# EAGLE design register (EAGLE 9.6.2)
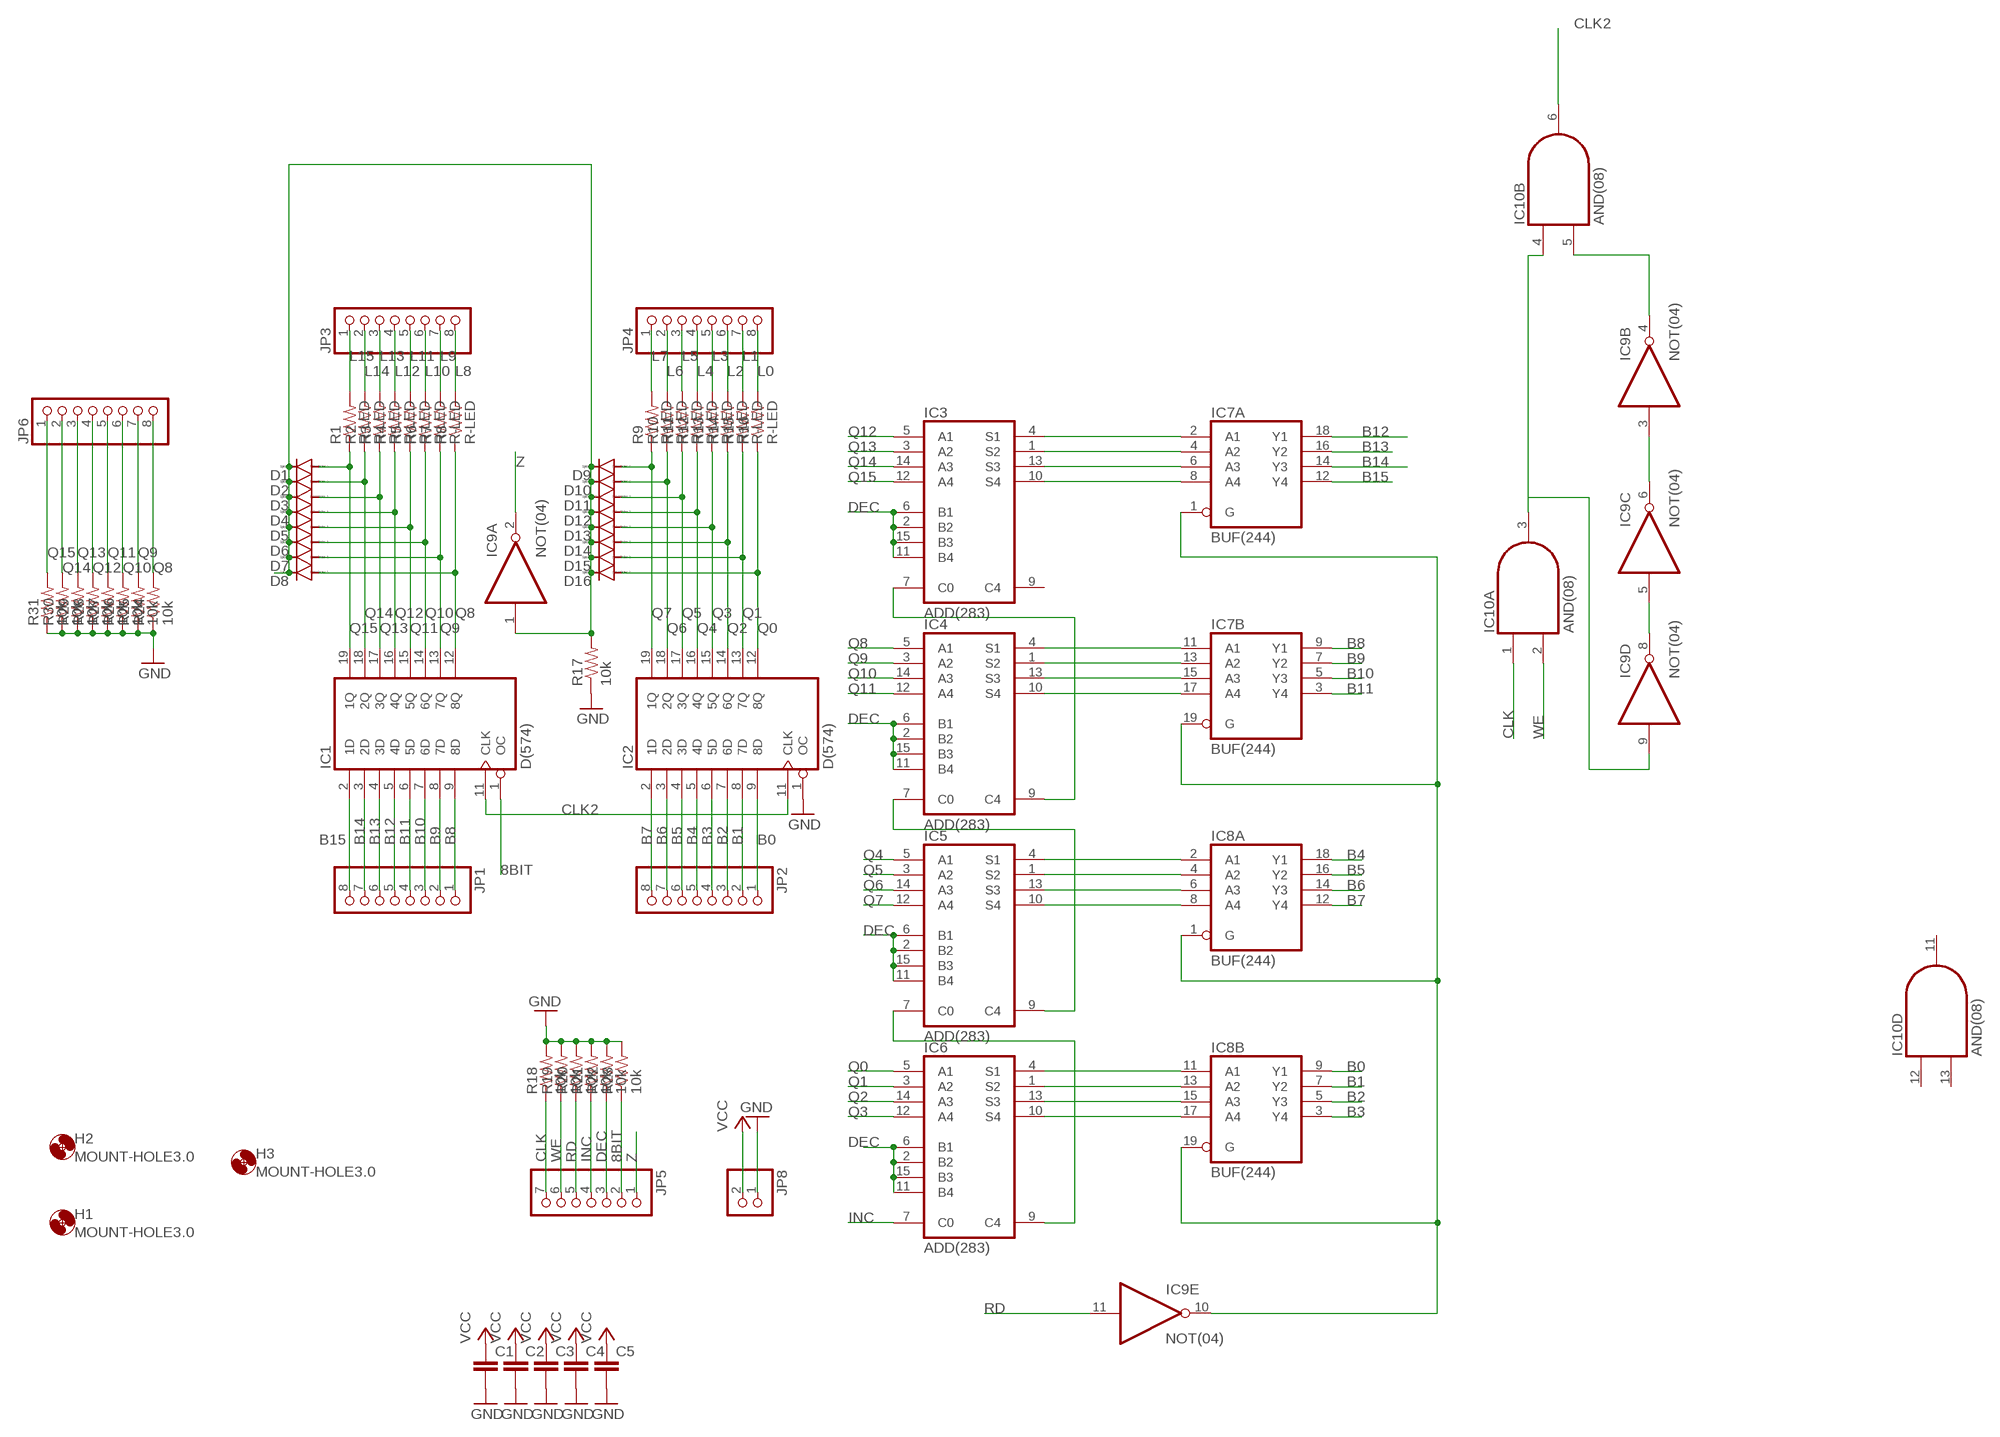
[diagram p0: schematic, sheet 1]

## Parts
C1  C-Decouple  C-EU025-025X050  [C025-025X050]
C2  C-Decouple  C-EU025-025X050  [C025-025X050]
C3  C-Decouple  C-EU025-025X050  [C025-025X050]
C4  C-Decouple  C-EU025-025X050  [C025-025X050]
C5  C-Decouple  C-EU025-025X050  [C025-025X050]
D1  DIODE-D-7.5  [D-7.5]
D2  DIODE-D-7.5  [D-7.5]
D3  DIODE-D-7.5  [D-7.5]
D4  DIODE-D-7.5  [D-7.5]
D5  DIODE-D-7.5  [D-7.5]
D6  DIODE-D-7.5  [D-7.5]
D7  DIODE-D-7.5  [D-7.5]
D8  DIODE-D-7.5  [D-7.5]
D9  DIODE-D-7.5  [D-7.5]
D10  DIODE-D-7.5  [D-7.5]
D11  DIODE-D-7.5  [D-7.5]
D12  DIODE-D-7.5  [D-7.5]
D13  DIODE-D-7.5  [D-7.5]
D14  DIODE-D-7.5  [D-7.5]
D15  DIODE-D-7.5  [D-7.5]
D16  DIODE-D-7.5  [D-7.5]
H1  MOUNT-HOLE3.0  [3,0]
H2  MOUNT-HOLE3.0  [3,0]
H3  MOUNT-HOLE3.0  [3,0]
IC1  D(574)  74AS574N  [DIL20]
IC2  D(574)  74AS574N  [DIL20]
IC3  ADD(283)  74AC283N  [DIL16]
IC4  ADD(283)  74AC283N  [DIL16]
IC5  ADD(283)  74AC283N  [DIL16]
IC6  ADD(283)  74AC283N  [DIL16]
IC7  BUF(244)  74AC244N  [DIL20]
IC8  BUF(244)  74AC244N  [DIL20]
IC9  NOT(04)  74ALS04N  [DIL14]
IC10  AND(08)  74ALS08N  [DIL14]
JP1  PINHD-1X8  [1X08]
JP2  PINHD-1X8  [1X08]
JP3  PINHD-1X8  [1X08]
JP4  PINHD-1X8  [1X08]
JP5  PINHD-1X7  [1X07]
JP6  PINHD-1X8  [1X08]
JP8  PINHD-1X2  [1X02]
R1  R-LED  R-US_0204/7  [0204/7]
R2  R-LED  R-US_0204/7  [0204/7]
R3  R-LED  R-US_0204/7  [0204/7]
R4  R-LED  R-US_0204/7  [0204/7]
R5  R-LED  R-US_0204/7  [0204/7]
R6  R-LED  R-US_0204/7  [0204/7]
R7  R-LED  R-US_0204/7  [0204/7]
R8  R-LED  R-US_0204/7  [0204/7]
R9  R-LED  R-US_0204/7  [0204/7]
R10  R-LED  R-US_0204/7  [0204/7]
R11  R-LED  R-US_0204/7  [0204/7]
R12  R-LED  R-US_0204/7  [0204/7]
R13  R-LED  R-US_0204/7  [0204/7]
R14  R-LED  R-US_0204/7  [0204/7]
R15  R-LED  R-US_0204/7  [0204/7]
R16  R-LED  R-US_0204/7  [0204/7]
R17  10k  R-US_0204/7  [0204/7]
R18  10k  R-US_0204/7  [0204/7]
R19  10k  R-US_0204/7  [0204/7]
R20  10k  R-US_0204/7  [0204/7]
R21  10k  R-US_0204/7  [0204/7]
R22  10k  R-US_0204/7  [0204/7]
R23  10k  R-US_0204/7  [0204/7]
R24  10k  R-US_0204/7  [0204/7]
R25  10k  R-US_0204/7  [0204/7]
R26  10k  R-US_0204/7  [0204/7]
R27  10k  R-US_0204/7  [0204/7]
R28  10k  R-US_0204/7  [0204/7]
R29  10k  R-US_0204/7  [0204/7]
R30  10k  R-US_0204/7  [0204/7]
R31  10k  R-US_0204/7  [0204/7]

## Nets
8BIT: IC1.1(OC) JP5.2 R23.1
B0: IC2.9(8D) IC8.9(B:Y1) JP2.1
B1: IC2.8(7D) IC8.7(B:Y2) JP2.2
B2: IC2.7(6D) IC8.5(B:Y3) JP2.3
B3: IC2.6(5D) IC8.3(B:Y4) JP2.4
B4: IC2.5(4D) IC8.18(A:Y1) JP2.5
B5: IC2.4(3D) IC8.16(A:Y2) JP2.6
B6: IC2.3(2D) IC8.14(A:Y3) JP2.7
B7: IC2.2(1D) IC8.12(A:Y4) JP2.8
B8: IC1.9(8D) IC7.9(B:Y1) JP1.1
B9: IC1.8(7D) IC7.7(B:Y2) JP1.2
B10: IC1.7(6D) IC7.5(B:Y3) JP1.3
B11: IC1.6(5D) IC7.3(B:Y4) JP1.4
B12: IC1.5(4D) IC7.18(A:Y1) JP1.5
B13: IC1.4(3D) IC7.16(A:Y2) JP1.6
B14: IC1.3(2D) IC7.14(A:Y3) JP1.7
B15: IC1.2(1D) IC7.12(A:Y4) JP1.8
CLK: IC10.1(A:I0) JP5.7 R18.1
CLK2: IC1.11(CLK) IC2.11(CLK) IC10.6(B:O)
DEC: IC3.2(B2) IC3.6(B1) IC3.11(B4) IC3.15(B3) IC4.2(B2) IC4.6(B1) IC4.11(B4) IC4.15(B3) IC5.2(B2) IC5.6(B1) IC5.11(B4) IC5.15(B3) IC6.2(B2) IC6.6(B1) IC6.11(B4) IC6.15(B3) JP5.3 R22.1
GND: C1.2 C2.2 C3.2 C4.2 C5.2 IC2.1(OC) JP8.1 R17.1 R18.2 R19.2 R20.2 R21.2 R22.2 R23.2 R24.1 R25.1 R26.1 R27.1 R28.1 R29.1 R30.1 R31.1
INC: IC6.7(C0) JP5.4 R21.1
L0: JP4.8 R16.2
L1: JP4.7 R15.2
L2: JP4.6 R14.2
L3: JP4.5 R13.2
L4: JP4.4 R12.2
L5: JP4.3 R11.2
L6: JP4.2 R10.2
L7: JP4.1 R9.2
L8: JP3.8 R8.2
L9: JP3.7 R7.2
L10: JP3.6 R6.2
L11: JP3.5 R5.2
L12: JP3.4 R4.2
L13: JP3.3 R3.2
L14: JP3.2 R2.2
L15: JP3.1 R1.2
N$1: IC5.7(C0) IC6.9(C4)
N$2: IC9.9(D:I) IC10.3(A:O) IC10.4(B:I0)
N$3: D1.C D2.C D3.C D4.C D5.C D6.C D7.C D8.C D9.C D10.C D11.C D12.C D13.C D14.C D15.C D16.C IC9.1(A:I) R17.2
N$4: IC7.1(A:G) IC7.19(B:G) IC8.1(A:G) IC8.19(B:G) IC9.10(E:O)
N$5: IC9.4(B:O) IC10.5(B:I1)
N$6: IC9.3(B:I) IC9.6(C:O)
N$7: IC9.5(C:I) IC9.8(D:O)
N$16: IC4.7(C0) IC5.9(C4)
N$17: IC3.7(C0) IC4.9(C4)
N$18: IC3.4(S1) IC7.2(A:A1)
N$19: IC3.1(S2) IC7.4(A:A2)
N$20: IC3.13(S3) IC7.6(A:A3)
N$21: IC3.10(S4) IC7.8(A:A4)
N$22: IC4.4(S1) IC7.11(B:A1)
N$23: IC4.1(S2) IC7.13(B:A2)
N$24: IC4.13(S3) IC7.15(B:A3)
N$25: IC4.10(S4) IC7.17(B:A4)
N$26: IC5.4(S1) IC8.2(A:A1)
N$27: IC5.1(S2) IC8.4(A:A2)
N$28: IC5.13(S3) IC8.6(A:A3)
N$29: IC5.10(S4) IC8.8(A:A4)
N$30: IC6.4(S1) IC8.11(B:A1)
N$47: IC6.1(S2) IC8.13(B:A2)
N$48: IC6.13(S3) IC8.15(B:A3)
N$49: IC6.10(S4) IC8.17(B:A4)
Q0: D16.A IC2.12(8Q) IC6.5(A1) R16.1
Q1: D15.A IC2.13(7Q) IC6.3(A2) R15.1
Q2: D14.A IC2.14(6Q) IC6.14(A3) R14.1
Q3: D13.A IC2.15(5Q) IC6.12(A4) R13.1
Q4: D12.A IC2.16(4Q) IC5.5(A1) R12.1
Q5: D11.A IC2.17(3Q) IC5.3(A2) R11.1
Q6: D10.A IC2.18(2Q) IC5.14(A3) R10.1
Q7: D9.A IC2.19(1Q) IC5.12(A4) R9.1
Q8: D8.A IC1.12(8Q) IC4.5(A1) JP6.8 R8.1 R24.2
Q9: D7.A IC1.13(7Q) IC4.3(A2) JP6.7 R7.1 R25.2
Q10: D6.A IC1.14(6Q) IC4.14(A3) JP6.6 R6.1 R26.2
Q11: D5.A IC1.15(5Q) IC4.12(A4) JP6.5 R5.1 R27.2
Q12: D4.A IC1.16(4Q) IC3.5(A1) JP6.4 R4.1 R28.2
Q13: D3.A IC1.17(3Q) IC3.3(A2) JP6.3 R3.1 R29.2
Q14: D2.A IC1.18(2Q) IC3.14(A3) JP6.2 R2.1 R30.2
Q15: D1.A IC1.19(1Q) IC3.12(A4) JP6.1 R1.1 R31.2
RD: IC9.11(E:I) JP5.5 R20.1
VCC: C1.1 C2.1 C3.1 C4.1 C5.1 JP8.2
WE: IC10.2(A:I1) JP5.6 R19.1
Z: IC9.2(A:O) JP5.1
Unconnected: IC3.9(C4) IC9.12(F:O) IC9.13(F:I) IC10.8(C:O) IC10.9(C:I0) IC10.10(C:I1) IC10.11(D:O) IC10.12(D:I0) IC10.13(D:I1)

## Power pins joined to a net without a drawn wire
GND: IC1.10(GND) IC2.10(GND) IC3.8(GND) IC4.8(GND) IC5.8(GND) IC6.8(GND) IC7.10(P:GND) IC8.10(P:GND) IC9.7(P:GND) IC10.7(P:GND)
VCC: IC1.20(VCC) IC2.20(VCC) IC3.16(VCC) IC4.16(VCC) IC5.16(VCC) IC6.16(VCC) IC7.20(P:VCC) IC8.20(P:VCC) IC9.14(P:VCC) IC10.14(P:VCC)

## Library data of the parts
C1-C5 = rcl:C-EU: CAPACITOR, European symbol; SPICEPREFIX: C
D1-D16 = diode:DIODE-: DIODE
H1-H3 = holes:MOUNT-HOLE: MOUNTING HOLE with drill center marker
IC1 IC2 = 74xx-us:74*574: 8-bit D type FLIP FLOP bus driver; MOUSER: 595-SN74HCT574NE4
IC3-IC6 = 74xx-eu:74*283: 4-bit binary FULL ADDER, fast carry; MOUSER: 595-CD74HCT283E
IC7 IC8 = 74xx-eu:74*244: Octal BUFFER and LINE DRIVER, 3-state; MOUSER: 595-SN74HCT244NE4
IC9 = 74xx-us:74*04: Hex INVERTER; MOUSER: 595-SN74HCT04NE4
IC10 = 74xx-us:74*08: Quad 2-input AND gate; MOUSER: 595-SN74HC08AN
JP1-JP4 JP6 = pinhead:PINHD-1X8: PIN HEADER
JP5 = pinhead:PINHD-1X7: PIN HEADER
JP8 = pinhead:PINHD-1X2: PIN HEADER
R1-R16 = rcl:R-US_: RESISTOR, American symbol; SPICEPREFIX: R
R17-R31 = rcl:R-US_: RESISTOR, American symbol; MOUSER: 603-MFR-12FRF5210K; SPICEPREFIX: R

## Board
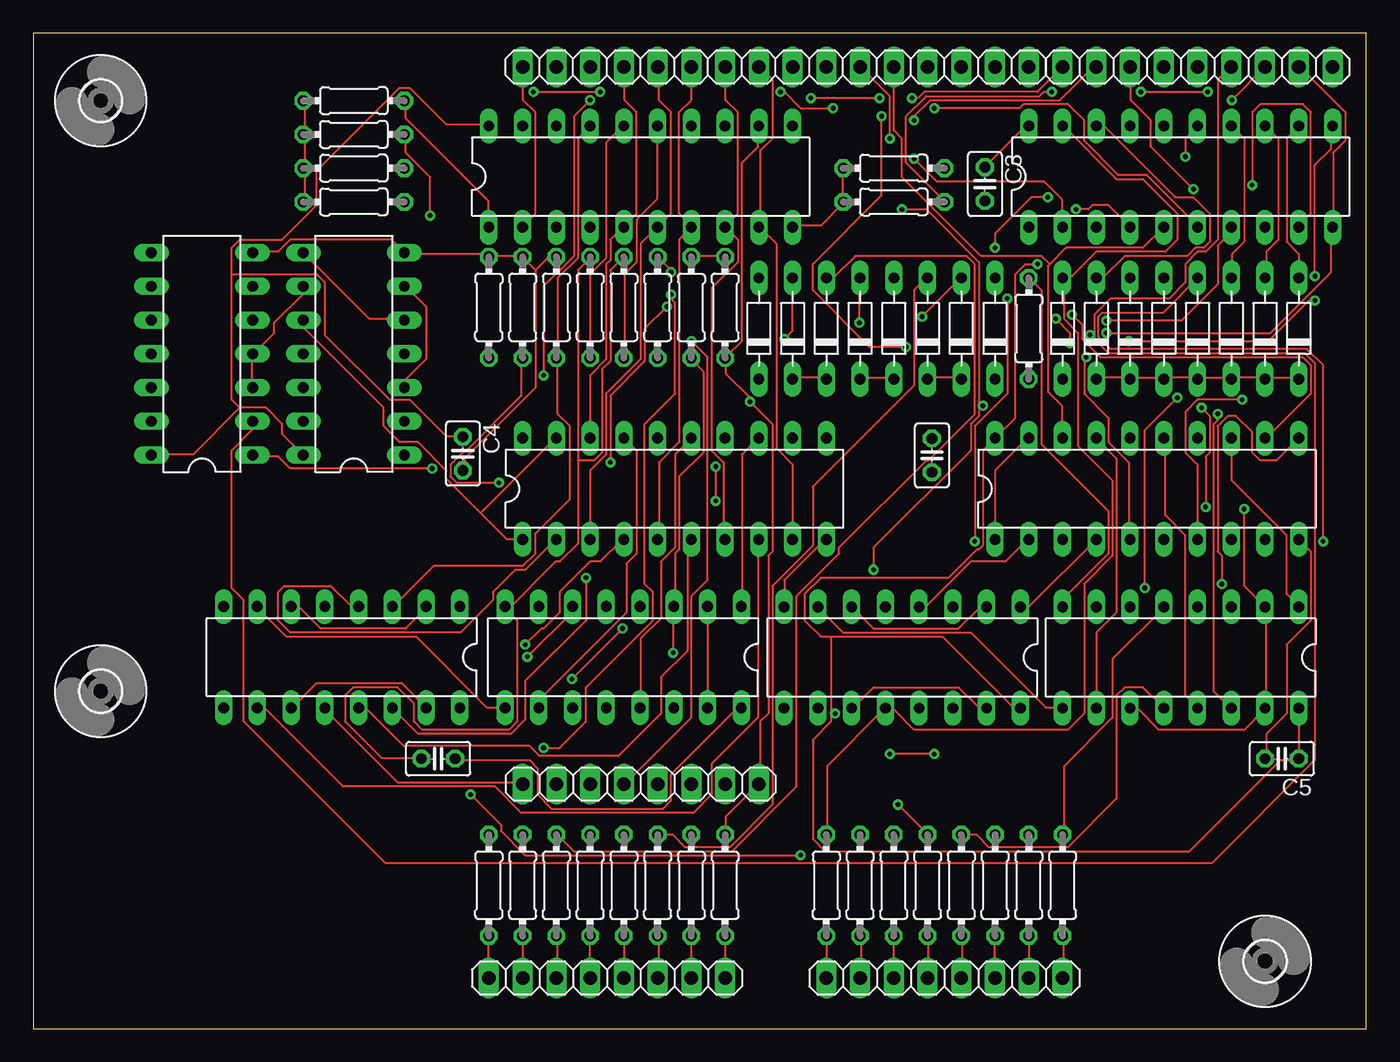
[diagram p1: board, top side]
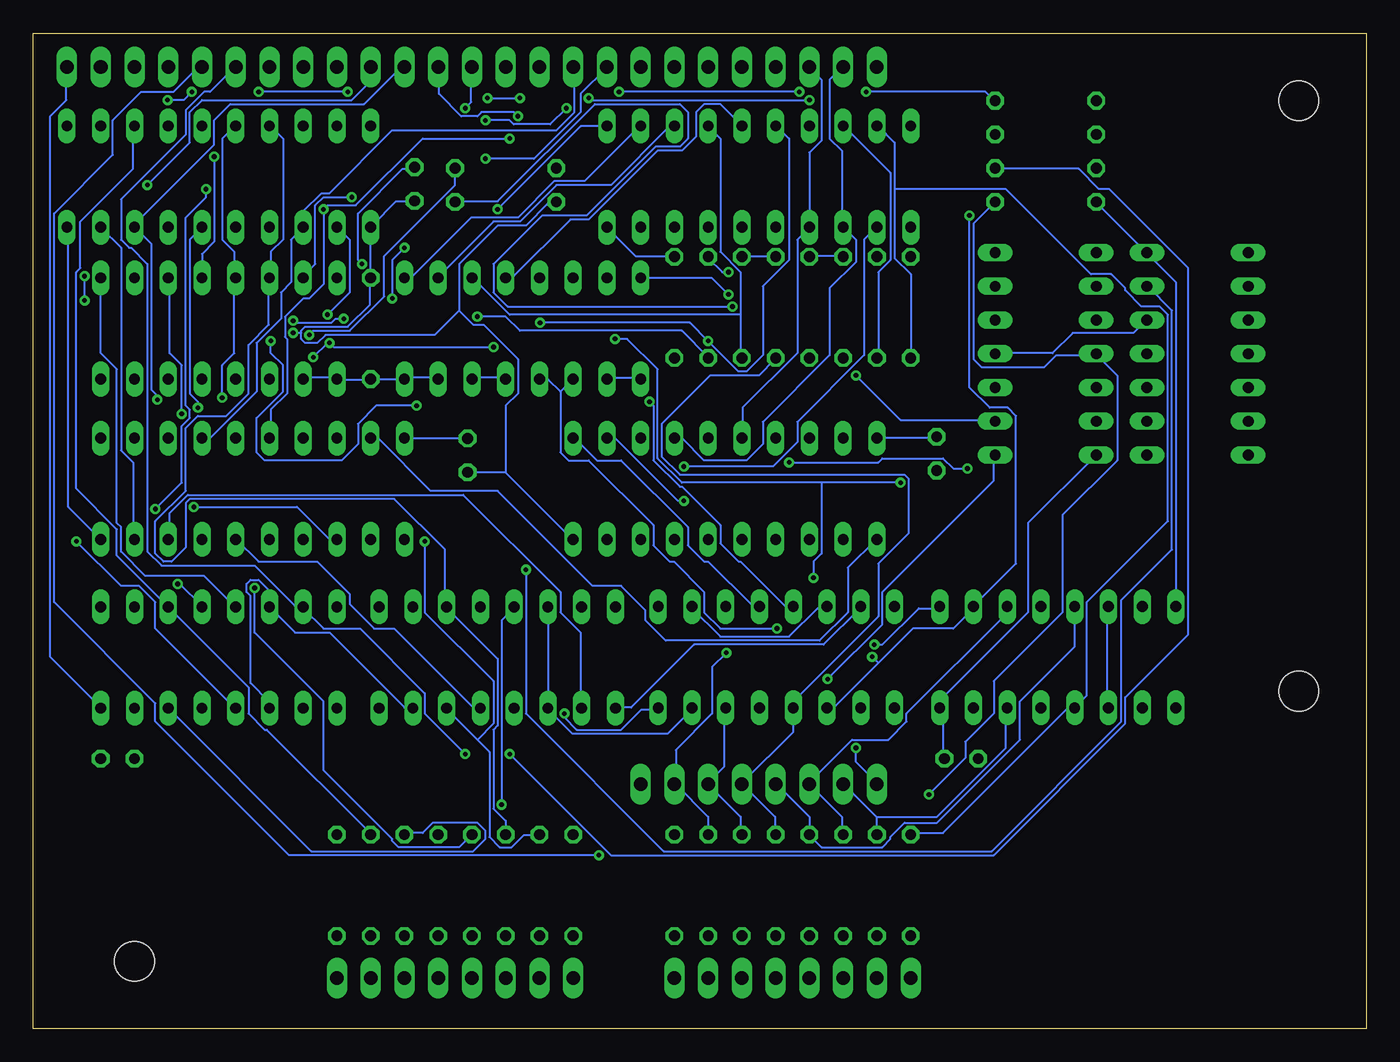
[diagram p2: board, bottom side, seen from below]

Size 100.33 x 74.93 mm. Coordinates in mm from the lower left corner, seen from the top.
Outline: 100.33,74.93 0,74.93 0,0 100.33,0.01 100.33,74.93
Copper layers (1*16): Top 0.035mm / dielectric 1.5mm / Bottom 0.035mm
Design rules "default": minimum track width 6mil, minimum drill 0.35mm, track to track 6mil, track to pad 6mil, pad to pad 6mil, via to via 6mil, smd to smd 6mil, copper to edge 40mil, drill to drill 6mil, minimum pad ring 10mil, minimum via ring 8mil, stop-mask expansion 4mil, vias tented up to drill 0mil, thermal gap 10mil

### Footprints (pad centres in the part's own frame; a part is rotated, then mirrored left to right if it is on the bottom)
C025-025X050 = drill 0.813 octagon: 1 -1.27,0; 2 1.27,0
D-7.5 = drill 0.813 long: A 3.81,0; C -3.81,0
3,0 = hole 3: 0,0
DIL20 = drill 0.813 long: 1 -11.43,-3.81; 2 -8.89,-3.81; 3 -6.35,-3.81; 4 -3.81,-3.81; 5 -1.27,-3.81; 6 1.27,-3.81; 7 3.81,-3.81; 8 6.35,-3.81; 9 8.89,-3.81; 10 11.43,-3.81; 11 11.43,3.81; 12 8.89,3.81; 13 6.35,3.81; 14 3.81,3.81; 15 1.27,3.81; 16 -1.27,3.81; 17 -3.81,3.81; 18 -6.35,3.81; 19 -8.89,3.81; 20 -11.43,3.81
DIL16 = drill 0.813 long: 1 -8.89,-3.81; 2 -6.35,-3.81; 3 -3.81,-3.81; 4 -1.27,-3.81; 5 1.27,-3.81; 6 3.81,-3.81; 7 6.35,-3.81; 8 8.89,-3.81; 9 8.89,3.81; 10 6.35,3.81; 11 3.81,3.81; 12 1.27,3.81; 13 -1.27,3.81; 14 -3.81,3.81; 15 -6.35,3.81; 16 -8.89,3.81
DIL14 = drill 0.813 long: 1 -7.62,-3.81; 2 -5.08,-3.81; 3 -2.54,-3.81; 4 0,-3.81; 5 2.54,-3.81; 6 5.08,-3.81; 7 7.62,-3.81; 8 7.62,3.81; 9 5.08,3.81; 10 2.54,3.81; 11 0,3.81; 12 -2.54,3.81; 13 -5.08,3.81; 14 -7.62,3.81
1X08 = drill 1.016 long: 1 -8.89,0; 2 -6.35,0; 3 -3.81,0; 4 -1.27,0; 5 1.27,0; 6 3.81,0; 7 6.35,0; 8 8.89,0
1X07 = drill 1.016 long: 1 -7.62,0; 2 -5.08,0; 3 -2.54,0; 4 0,0; 5 2.54,0; 6 5.08,0; 7 7.62,0
1X02 = drill 1.016 long: 1 -1.27,0; 2 1.27,0
0204/7 = drill 0.813 octagon: 1 -3.81,0; 2 3.81,0

### Placement (x,y rotation side)
C1  30.48,20.32 180 top
C2  67.64,43.15 270 top
C3  71.63,63.58 270 top
C4  32.33,43.28 270 top
C5  93.98,20.32 180 top
D1  54.61,52.7 90 top
D2  57.15,52.7 90 top
D3  59.69,52.7 90 top
D4  62.23,52.7 90 top
D5  64.77,52.7 90 top
D6  67.31,52.7 90 top
D7  69.85,52.7 90 top
D8  72.39,52.7 90 top
D9  77.47,52.7 90 top
D10  80.01,52.7 90 top
D11  82.55,52.7 90 top
D12  85.09,52.7 90 top
D13  87.63,52.7 90 top
D14  90.17,52.7 90 top
D15  92.71,52.7 90 top
D16  95.25,52.7 90 top
H1  92.71,5.08 0 top
H2  5.08,69.85 0 top
H3  5.08,25.4 0 top
IC1  45.72,64.14 0 top
IC2  86.36,64.14 0 top
IC3  23.22,27.97 180 top
IC4  44.4,27.97 180 top
IC5  65.41,27.94 180 top
IC6  86.36,27.94 180 top
IC7  48.26,40.64 0 top
IC8  83.82,40.64 0 top
IC9  24.13,50.8 90 top
IC10  12.7,50.8 90 top
JP1  45.72,72.39 180 top
JP2  66.04,72.39 180 top
JP3  43.18,3.81 0 top
JP4  68.58,3.81 0 top
JP5  85.09,72.39 0 top
JP6  45.72,18.41 0 top
JP8  96.52,72.39 0 top
R1  34.29,10.79 270 top
R2  36.83,10.79 270 top
R3  39.37,10.79 270 top
R4  41.91,10.79 270 top
R5  44.45,10.79 270 top
R6  46.99,10.79 270 top
R7  49.53,10.79 270 top
R8  52.07,10.79 270 top
R9  59.69,10.79 270 top
R10  62.23,10.79 270 top
R11  64.77,10.79 270 top
R12  67.31,10.79 270 top
R13  69.85,10.79 270 top
R14  72.39,10.79 270 top
R15  74.93,10.79 270 top
R16  77.47,10.79 270 top
R17  74.93,52.7 270 top
R18  64.77,62.23 180 top
R19  64.77,64.77 180 top
R20  24.13,62.23 180 top
R21  24.13,64.77 180 top
R22  24.13,67.31 180 top
R23  24.13,69.85 180 top
R24  52.07,54.29 270 top
R25  49.53,54.29 270 top
R26  46.99,54.29 270 top
R27  44.45,54.29 270 top
R28  41.91,54.29 270 top
R29  39.37,54.29 270 top
R30  36.83,54.29 270 top
R31  34.29,54.29 270 top

### Tracks (layer width: path | path; a pad name or v marks a point on that pad's centre or on a via)
8BIT  (via drill 0.35)
  Top 0.152: IC1.1 34.29,62.28 28.04,68.53 28.04,69.75 R23.1 | v66.29,68.38 66.29,68.68 67.51,69.9 77.27,69.9 79.7,72.34 80.01,72.34 JP5.2 | v60.2,69.29 57.76,69.29 56.54,70.51 v56.24,70.51 | v37.64,70.51 v42.67,70.51
  Bottom 0.152: v66.29,68.38 64.47,68.38 64.16,68.07 61.42,68.07 v60.2,69.29 | v42.67,70.51 v56.24,70.51 | v37.64,70.51 28.65,70.51 28.04,69.9 R23.1
B0  (via drill 0.35)
  Top 0.152: v91.75,63.5 91.75,68.99 92.35,69.6 95.56,69.6 96.16,68.99 96.16,61.37 95.25,60.45 IC2.9
  Bottom 0.152: IC8.9 92.81,36.83 92.81,42.62 93.73,43.54 93.73,58.78 95.25,60.3 IC2.9 | v91.75,63.5 88.54,66.7 88.54,68.99 87.63,69.9 76.35,69.9 74.98,71.27 74.98,72.34 JP2.1
B1  (via drill 0.35)
  Top 0.152: IC8.7 87.63,42.47 86.72,43.38 86.72,46.43 87.63,47.35 v90.98,47.35
  Bottom 0.152: v90.98,47.35 90.98,47.65 91.44,48.11 91.44,59.08 92.66,60.3 IC2.8 92.81,60.45 86.72,66.55 86.72,68.38 85.5,69.6 75.44,69.6 72.69,72.34 72.39,72.34 JP2.2
B2  (via drill 0.35)
  Top 0.152: v79.25,50.55 79.1,50.39 79.1,47.8 80.92,45.97 80.92,44.15 82.45,42.62 82.45,36.83 IC8.5 | v78.03,51.61 78.03,52.38 v76.96,53.44 | v80.77,53.29 86.41,53.29 89.15,56.03 89.15,58.93 90.07,59.84 90.07,60.3 IC2.7 | v63.86,68.68 63.86,62.74 58.67,57.56 58.67,55.58 62.94,51.31 v65.68,51.31
  Bottom 0.152: v79.25,50.55 78.18,51.61 v78.03,51.61 77.72,51.31 v65.68,51.31 | v76.96,53.44 77.57,53.44 77.88,53.14 80.62,53.14 v80.77,53.29 | v63.86,68.68 64.16,68.99 66.6,68.99 66.9,68.68 68.12,68.68 69.8,70.36 69.8,72.34 JP2.3
B3  (via drill 0.35)
  Top 0.152: v88.24,39.27 88.24,43.08 88.54,43.38 88.54,46.13 v87.94,46.74 | v67.82,69.29 74.22,69.29 74.52,69.6 77.88,69.6 79.1,68.38 79.1,66.85 81.69,64.26 83.82,64.26 87.63,60.45 IC2.6
  Bottom 0.152: IC8.3 78.03,36.83 80.47,39.27 v88.24,39.27 | v87.94,46.74 87.94,47.19 88.54,47.8 88.54,59.39 87.63,60.3 IC2.6 | v67.82,69.29 67.36,69.75 67.36,72.34 JP2.4
B4
  Top 0.152: 76.5,57.56 77.72,58.78 83.52,58.78 85.04,60.3 IC2.5 | 76.5,57.56 76.35,57.4 76.35,47.95 77.42,46.89 77.42,44.45 IC8.18 | JP2.5 64.77,67.61 65.38,67 65.38,64.11 71.32,58.17 75.89,58.17 76.5,57.56
B5  (via drill 0.35)
  Top 0.152: v78.49,61.67 79.4,61.67 79.7,61.98 80.92,61.98 82.45,60.45 IC2.4 | v64.47,67 64.47,70.21 62.33,72.34 JP2.6
  Bottom 0.152: IC8.16 82.45,44.45 82.45,46.58 81.23,47.8 81.23,51.92 81.38,52.07 81.38,53.59 80.01,54.97 79.55,54.97 78.49,56.03 v78.49,61.67 78.18,61.98 76.05,61.98 71.02,67 v64.47,67
B6
  Bottom 0.152: IC8.14 87.02,44.45 83.52,47.95 83.52,51.61 81.69,53.44 81.69,55.42 80.92,56.19 80.92,59.39 80.01,60.3 IC2.3 80.01,61.52 78.64,62.89 78.03,62.89 73.3,67.61 60.96,67.61 59.59,68.99 59.59,72.34 JP2.7
B7  (via drill 0.35)
  Top 0.152: v66.29,65.48 67.97,63.81 76.05,63.81 77.42,62.43 77.42,60.45 IC2.2 | v78.18,53.75 78.94,52.98 78.94,51.92 80.31,50.55 95.56,50.55 96.16,49.94 96.16,47.8 92.81,44.45 IC8.12
  Bottom 0.152: v66.29,65.48 62.64,65.48 59.13,68.99 59.13,70.36 57.15,72.34 JP2.8 | v78.18,53.75 76.5,55.42 76.5,59.39 77.42,60.3 IC2.2
B8
  Top 0.152: JP1.1 54.71,72.34 55.63,71.42 55.63,67 54.71,66.09 54.71,60.45 IC1.9 54.71,60.3 55.93,59.08 55.93,43.69 57.15,42.47 IC7.9
B9
  Top 0.152: IC7.7 51.97,36.83 51.97,42.62 51.05,43.54 51.05,55.73 53.03,57.71 53.03,59.39 52.12,60.3 IC1.8 52.12,60.45 53.03,61.37 53.03,68.99 52.12,69.9 52.12,72.34 JP1.2
B10
  Top 0.152: IC7.5 47.09,36.83 47.09,42.62 48.62,44.15 48.62,59.39 49.53,60.3 IC1.7 49.53,60.45 48.62,61.37 48.62,68.99 49.53,69.9 JP1.3
B11
  Top 0.152: IC7.3 41.91,42.01 43.13,43.23 43.13,47.8 45.72,50.39 45.72,59.08 46.94,60.3 IC1.6 47.09,60.45 48.01,61.37 48.01,68.99 47.09,69.9 47.09,72.34 JP1.4
B12
  Top 0.152: IC7.18 41.91,49.17 43.13,50.39 43.13,57.56 43.43,57.86 43.43,59.39 44.35,60.3 IC1.5 44.5,60.45 45.41,61.37 45.41,68.99 44.5,69.9 44.5,72.34 JP1.5
B13
  Bottom 0.152: JP1.6 41.91,72.34 41,71.42 41,66.85 41.91,65.94 IC1.4 41.91,60.3 42.82,59.39 42.82,50.85 46.94,46.74 46.94,44.45 IC7.16
B14
  Bottom 0.152: JP1.7 39.47,72.34 40.39,71.42 40.39,67 39.47,66.09 39.47,60.45 IC1.3 39.32,60.3 38.41,59.39 38.41,57.71 40.39,55.73 40.39,50.7 45.41,45.67 45.41,43.99 46.63,42.77 49.84,42.77 51.51,44.45 IC7.14
B15  (via drill 0.35)
  Top 0.152: v51.36,42.32 v51.36,39.73 | JP1.8 36.88,72.34 36.88,69.9 37.8,68.99 37.8,61.37 36.88,60.45 IC1.2
  Bottom 0.152: IC7.12 56.54,44.45 51.82,39.73 v51.36,39.73 | v51.36,42.32 44.65,42.32 42.82,44.15 42.82,45.67 37.8,50.7 37.8,59.39 36.88,60.3 IC1.2
CLK  (via drill 0.35)
  Top 0.152: v30.02,42.16 19.36,42.16 18.44,43.08 16.61,43.08 IC10.1 | v43.43,42.62 43.43,47.65 46.02,50.24 46.02,52.68 v47.7,54.36 | v90.22,69.9 JP5.7 | v83.36,70.51 v88.39,70.51 | v76.66,70.51 76.05,70.51 75.74,70.21 67.21,70.21 65.68,68.68 65.68,65.18 68.58,62.28 R18.1
  Bottom 0.152: v30.02,42.16 31.09,42.16 31.85,42.93 36.42,42.93 36.73,42.62 v43.43,42.62 | v47.7,54.36 64.62,54.36 65.68,55.42 65.68,57.56 62.03,61.21 58.67,61.21 53.49,66.4 51.66,66.4 51.05,67 51.05,68.99 51.66,69.6 58.06,69.6 65.38,62.28 68.58,62.28 R18.1 | v90.22,69.9 89,69.9 v88.39,70.51 | v76.66,70.51 v83.36,70.51
CLK2  (via drill 0.35)
  Top 0.152: v63.25,34.54 63.25,36.22 70.56,43.54 70.56,45.52 71.17,46.13 71.17,46.89 | 71.17,46.89 71.17,57.71 67.21,61.67 v65.38,61.67 | v96.47,56.64 96.47,65.02 97.69,66.24 97.69,67.92 IC2.11 | v96.47,54.81 96.01,54.81 92.96,51.77 v82.45,51.77 | 71.17,46.89 v71.48,46.89
  Bottom 0.152: v63.25,34.54 63.25,23.72 52.88,13.36 28.19,13.36 18.44,23.11 18.44,32.26 14.63,36.07 14.63,54.05 16.46,55.88 IC10.6 | v65.38,61.67 59.13,67.92 57.15,67.92 IC1.11 | v96.47,54.81 v96.47,56.64 | v82.45,51.77 82.45,50.85 81.53,49.94 81.53,47.95 83.52,45.97 83.52,43.38 82.91,42.77 77.11,42.77 75.89,43.99 75.89,45.52 74.52,46.89 v71.48,46.89
DEC  (via drill 0.35)
  Top 0.152: IC3.15 29.57,24.18 27.74,26.01 21.34,26.01 19.51,24.18 IC3.11 | v29.87,61.21 29.87,64.11 28.04,65.94 28.04,67.31 R22.1 | IC3.6 19.51,31.65 20.12,31.65 21.64,30.12 28.04,30.12 29.57,31.65 IC3.2 | IC5.15 71.63,24.18 71.17,24.18 69.65,25.7 63.25,25.7 61.72,24.18 IC5.11 | IC5.2 71.63,31.65 71.17,31.65 69.65,30.12 63.25,30.12 61.72,31.65 IC5.6 | IC4.2 IC4.15 | IC6.11 82.6,24.03 83.21,24.03 84.73,22.5 91.14,22.5 92.66,24.03 IC6.15 92.81,24.18 92.81,31.65 IC6.2 91.14,33.33 v91.14,39.12 | v87.33,63.2 84.12,66.4 84.12,68.38 82.6,69.9 82.6,72.34 JP5.3 | v37.19,27.99 40.54,31.34 40.54,31.65 IC4.6
  Bottom 0.152: IC3.11 19.51,24.18 19.51,31.65 IC3.6 | 36.73,27.53 34.14,30.12 31.09,30.12 29.57,31.65 IC3.2 29.57,31.8 26.36,35 26.36,46.13 26.98,46.74 28.35,46.74 29.87,48.26 v29.87,61.21 | 36.73,27.53 40.08,24.18 40.54,24.18 IC4.11 | IC5.6 61.57,31.65 61.57,24.18 IC5.11 61.57,24.03 59.74,22.2 52.58,22.2 50.75,24.03 IC4.15 | IC4.6 40.69,31.65 41.3,31.65 43.43,29.52 48.62,29.52 50.75,31.65 IC4.2 | IC6.11 82.6,24.18 82.6,24.64 83.97,26.01 83.97,32.56 84.28,32.87 84.28,33.48 83.97,33.78 83.36,33.78 82.6,33.02 82.6,31.8 IC6.6 80.62,29.82 78.03,29.82 72.39,24.18 71.78,24.18 IC5.15 | v87.33,63.2 87.33,62.59 88.85,61.06 88.85,46.89 88.54,46.58 88.54,45.97 89.15,45.36 89.15,41.1 v91.14,39.12 | v37.19,27.99 36.73,27.53
GND  (via drill 0.35)
  Top 0.152: R20.2 20.42,62.28 20.42,64.72 R21.2 20.42,64.87 20.42,67.31 | 20.42,67.31 20.42,69.75 R23.2 | 20.42,67.31 R22.2 | 35.66,31.5 35.51,31.65 IC4.8 35.66,31.5 | 35.66,31.5 36.42,30.73 36.42,23.11 35.81,22.5 29.26,22.5 28.65,23.11 28.65,24.49 27.43,25.7 24.08,25.7 23.47,25.09 23.47,23.11 26.21,20.37 29.11,20.37 C1.2 | 37.8,57.1 37.8,48.26 32.46,42.93 32.46,42.01 C4.2 | 37.8,57.1 36.88,58.01 R30.1 36.73,58.17 34.29,58.17 | 37.8,57.1 38.71,58.01 39.32,58.01 R29.1 | 34.29,58.17 34.14,58.32 28.04,58.32 IC9.7 26.98,59.39 19.36,59.39 18.44,58.47 16.61,58.47 IC10.7 | 34.29,58.17 R31.1 | 35.66,31.5 39.32,35.15 39.62,35.15 41,36.52 41,42.77 | 41,42.77 41,57.1 41.91,58.01 R28.1 | JP8.1 95.25,72.49 98.75,68.99 98.75,66.85 97.84,65.94 97.84,60.45 IC2.10 97.69,60.3 97.69,56.95 93.12,52.38 v80.77,52.38 | IC8.10 96.16,35.92 96.16,30.73 94.34,28.91 94.34,23.72 92.81,22.2 92.81,20.37 C5.2 | IC6.8 77.57,31.8 77.57,32.41 80.92,35.76 80.92,38.96 75.89,43.99 75.89,55.58 74.98,56.49 R17.1 | IC5.8 56.54,31.8 56.54,33.78 59.59,36.83 IC7.10 | R25.1 49.53,58.17 51.97,58.17 R24.1 | v48.01,56.95 48.01,57.1 47.09,58.01 R26.1 | IC1.10 57.15,60.45 59.28,60.45 60.96,62.13 R18.2 R19.2 | 41,42.77 42.22,42.77 42.82,43.38 42.82,49.63 43.43,50.24 43.43,57.1 44.35,58.01 R27.1
  Bottom 0.152: IC3.8 14.33,56.19 16.46,58.32 IC10.7 16.61,58.47 20.27,62.13 R20.2 | R28.1 41.91,58.17 39.47,58.17 R29.1 | IC8.10 97.69,39.27 97.69,60.3 IC2.10 | C3.2 71.63,62.28 73,62.28 74.83,60.45 IC2.1 74.98,60.3 74.98,56.64 R17.1 74.98,56.49 74.98,54.51 76.66,52.83 79.86,52.83 80.16,52.53 80.16,52.38 | 64.77,41.86 67.51,41.86 C2.2 | 64.77,41.86 59.74,36.83 IC7.10 | R27.1 44.5,58.17 46.94,58.17 R26.1 | v48.01,56.95 48.46,56.95 49.53,58.01 R25.1 | R24.1 52.12,58.17 55.02,58.17 57.15,60.3 IC1.10 | 64.77,41.86 64.77,46.89 63.86,47.8 63.86,50.39 66.45,52.98 67.21,52.98 68.28,54.05 | 68.28,54.05 68.28,57.56 65.38,60.45 63.25,60.45 61.57,62.13 60.96,62.13 R18.2 | 80.16,52.38 80.16,51.92 79.86,51.61 78.94,51.61 78.33,52.22 70.1,52.22 68.28,54.05 | 80.16,52.38 v80.77,52.38
INC  (via drill 0.35)
  Top 0.152: v67.82,20.68 v64.47,20.68
  Bottom 0.152: JP5.4 85.19,72.34 87.02,70.51 87.48,70.51 88.85,69.14 88.85,67.31 93.73,62.43 93.73,59.39 93.12,58.78 92.96,58.78 91.75,57.56 91.75,35.92 90.68,34.85 83.67,34.85 80.62,31.8 80.01,31.8 IC6.7 80.01,31.65 78.49,30.12 75.74,30.12 70.87,25.25 70.87,23.72 v67.82,20.68 | v64.47,20.68 56.84,13.06 28.04,13.06 18.14,22.96 18.14,24.94 13.41,29.67 13.41,57.25 19.36,63.2 20.12,63.2 21.64,64.72 27.89,64.72 R21.1
L0
  Top 0.152: R16.2 77.57,6.96 77.57,3.91 JP4.8
L1
  Top 0.152: R15.2 74.98,6.96 74.98,3.91 JP4.7
L2
  Top 0.152: JP4.6 R14.2
L3
  Top 0.152: R13.2 69.95,6.96 69.95,3.91 JP4.5
L4
  Top 0.152: R12.2 67.36,6.96 67.36,3.91 JP4.4
L5
  Top 0.152: JP4.3 R11.2
L6
  Top 0.152: R10.2 62.33,6.96 62.33,3.91 JP4.2
L7
  Top 0.152: R9.2 59.74,6.96 59.74,3.91 JP4.1
L8
  Top 0.152: R8.2 52.12,6.96 52.12,3.91 JP3.8
L9
  Top 0.152: JP3.7 R7.2
L10
  Top 0.152: R6.2 47.09,6.96 47.09,3.91 JP3.6
L11
  Top 0.152: R5.2 44.5,6.96 44.5,3.91 JP3.5
L12
  Top 0.152: JP3.4 R4.2
L13
  Top 0.152: R3.2 39.47,6.96 39.47,3.91 JP3.3
L14
  Top 0.152: R2.2 36.88,6.96 36.88,3.91 JP3.2
L15
  Top 0.152: JP3.1 R1.2
N$1
  Top 0.152: IC6.9 77.42,24.18 76.2,24.18 70.56,29.82 60.96,29.82 59.13,31.65 IC5.7
N$2
  Top 0.152: IC10.3 16.46,48.26 16.46,50.7 IC10.4 16.61,50.85 18.14,52.38 18.14,53.14 20.27,55.27 20.27,55.88 IC9.9
N$3  (via drill 0.35)
  Top 0.152: D16.C 95.25,49.02 92.81,49.02 D15.C 92.66,49.02 90.22,49.02 D14.C 90.07,49.02 87.63,49.02 | 87.63,49.02 85.19,49.02 D12.C 85.04,49.02 82.6,49.02 D11.C 82.45,49.02 80.01,49.02 D10.C | D6.C 67.36,49.02 69.8,49.02 D7.C | 87.63,49.02 D13.C | v44.35,30.12 v40.54,26.31 | D5.C 64.77,49.02 62.33,49.02 D4.C | D2.C 57.15,49.02 59.59,49.02 D3.C
  Bottom 0.152: D7.C 69.95,49.02 72.39,49.02 D8.C 72.39,48.87 74.83,48.87 R17.2 74.98,48.87 77.42,48.87 D9.C 77.57,49.02 80.01,49.02 D10.C | D1.C 54.71,49.02 57.15,49.02 D2.C | v40.54,26.31 36.42,30.43 36.42,32.87 28.04,41.25 28.04,43.08 IC9.1 | v44.35,30.12 48.62,30.12 49.84,31.34 49.84,32.87 52.12,35.15 52.43,35.15 53.65,36.37 53.65,37.9 58.52,42.77 60.05,42.77 60.66,43.38 60.66,47.95 | 60.66,47.95 59.74,48.87 D3.C | 60.66,47.95 61.57,48.87 62.18,48.87 D4.C | D6.C 67.21,49.02 64.77,49.02 D5.C
N$4
  Top 0.152: IC8.1 72.39,42.01 74.83,44.45 IC8.19 | 33.68,38.81 35.66,36.83 IC7.1 | 33.68,38.81 31.09,41.4 31.09,42.01 28.96,44.15 27.58,44.15 26.36,45.36 26.36,46.74 20.42,52.68 20.42,53.29 IC9.10 | 33.68,38.81 39.32,44.45 IC7.19
  Bottom 0.152: IC8.19 74.37,44.45 70.41,40.49 65.38,40.49 58.22,33.33 56.08,33.33 54.25,31.5 54.25,30.73 52.73,29.21 41.15,29.21 39.01,31.34 39.01,34.7 36.88,36.83 IC7.1
N$5
  Bottom 0.152: IC9.4 27.89,50.85 23.62,50.85 22.1,52.38 17.53,52.38 16.61,53.29 IC10.5
N$6
  Top 0.152: IC9.3 28.04,48.26 28.04,48.87 29.57,50.39 29.57,54.36 28.04,55.88 IC9.6
N$7
  Top 0.152: IC9.8 25.3,53.44 27.89,53.44 IC9.5
N$16
  Bottom 0.152: IC5.9 56.39,24.18 55.32,24.18 50.6,28.91 40.84,28.91 38.1,31.65 IC4.7
N$17
  Top 0.152: IC4.9 35.51,24.18 34.14,24.18 28.8,29.52 19.05,29.52 16.92,31.65 IC3.7
N$18
  Top 0.152: IC3.4 24.38,31.8 23.93,31.8 22.4,33.33 18.9,33.33 18.44,32.87 18.44,30.73 19.36,29.82 32.16,29.82 34.59,32.26 34.59,32.87 36.27,34.54 37.03,34.54 39.32,36.83 IC7.2
N$19  (via drill 0.35)
  Top 0.152: v37.03,28.91 38.25,30.12 38.41,30.12 39.62,31.34 39.62,32.87 41.91,35.15 42.67,35.15 44.35,36.83 IC7.4
  Bottom 0.152: v37.03,28.91 36.42,28.91 33.68,31.65 32.16,31.65 IC3.1
N$20
  Top 0.152: IC7.6 49.23,36.52 49.23,28.45 47.24,26.47 47.24,23.72 44.04,20.52 38.1,20.52 37.34,21.28 27.89,21.28 25.15,24.03 24.54,24.03 IC3.13
N$21
  Top 0.152: IC3.10 16.92,24.03 17.53,24.03 23.32,18.24 34.75,18.24 36.73,16.26 49.68,16.26 51.05,17.63 51.05,19.91 54.56,23.42 54.56,36.83 IC7.8
N$22
  Bottom 0.152: IC4.4 45.72,31.8 46.18,31.8 49.53,35.15 49.84,35.15 51.05,36.37 51.05,37.74 56.08,42.77 57.91,42.77 59.59,44.45 IC7.11
N$23
  Top 0.152: IC4.1 53.34,31.8 53.34,43.23 54.56,44.45 IC7.13
N$24
  Top 0.152: IC7.15 48.31,43.23 48.31,36.22 47.24,35.15 47.24,30.89 45.72,29.36 45.72,24.18 IC4.13
N$25
  Top 0.152: IC4.10 38.1,24.18 38.1,24.79 44.65,31.34 44.65,35 45.41,35.76 45.41,43.54 44.5,44.45 IC7.17
N$26
  Top 0.152: IC5.4 66.75,31.8 67.21,31.8 70.56,35.15 73.15,35.15 74.83,36.83 IC8.2
N$27
  Top 0.152: IC8.4 74.98,31.8 74.37,31.8 IC5.1
N$28
  Bottom 0.152: IC5.13 66.75,24.18 67.21,24.18 73.15,30.12 74.68,30.12 76.5,31.95 76.5,32.72 78.94,35.15 83.36,35.15 85.04,36.83 IC8.6
N$29
  Bottom 0.152: IC5.10 59.13,24.18 59.13,29.82 60.66,31.34 60.66,32.87 67.97,40.18 88.7,40.18 90.07,38.81 90.07,36.83 IC8.8
N$30  (via drill 0.35)
  Top 0.152: v89.46,33.48 89.46,35.61 89.15,35.92 89.15,45.36 89.92,46.13 90.53,46.13 91.75,44.91 91.75,43.38 92.35,42.77 93.57,42.77 IC8.11
  Bottom 0.152: v89.46,33.48 89.31,33.48 87.63,31.8 IC6.4
N$47
  Top 0.152: IC8.13 90.22,44.45 90.22,41.25 94.34,37.14 94.34,32.72 95.25,31.8 IC6.1
N$48
  Top 0.152: IC8.15 85.19,44.45 85.19,38.66 86.72,37.14 86.72,25.09 87.63,24.18 IC6.13
N$49
  Top 0.152: IC6.10 80.01,29.82 81.53,31.34 81.53,42.93 IC8.17
Q0
  Top 0.152: D16.A 95.25,58.32 94.34,59.23 94.34,67 95.25,67.92 IC2.12 | R16.1 77.57,14.73 77.57,19.76 81.23,23.42 81.23,27.84 85.04,31.65 IC6.5
  Bottom 0.152: D16.A 95.25,50.85 94.03,49.63 94.03,38.05 93.73,37.74 93.73,35.92 91.9,34.09 87.48,34.09 85.19,31.8 IC6.5
Q1
  Top 0.152: D15.A 92.81,56.64 92.81,58.47 93.73,59.39 93.73,67 92.81,67.92 IC2.13
  Bottom 0.152: R15.1 74.98,14.73 82.75,22.5 82.91,22.5 84.12,23.72 84.12,25.7 IC6.3 94.03,35.61 94.03,37.59 97.08,40.64 97.08,56.95 96.77,57.25 96.77,60.76 92.81,64.72 92.81,67.92 IC2.13
Q2  (via drill 0.35)
  Top 0.152: D14.A 90.22,56.64 90.22,58.32 91.14,59.23 91.14,67 90.22,67.92 IC2.14 | v89.15,46.28 89.15,45.82 88.85,45.52 88.85,25.4 90.07,24.18 IC6.14
  Bottom 0.152: IC6.14 79.4,13.36 67.21,13.36 66.29,14.28 66.29,14.88 66.9,15.49 70.26,15.49 71.02,14.73 72.39,14.73 R14.1 | v89.15,46.28 89.15,49.94 90.07,50.85 90.07,56.49 D14.A
Q3  (via drill 0.35)
  Top 0.152: v86.72,65.63 86.72,67 87.63,67.92 IC2.15 | IC6.12 83.52,25.7 82.14,25.7 81.53,25.09 81.53,17.32 77.88,13.67 71.93,13.67 71.02,14.58 69.95,14.58 R13.1 | v97.08,36.68 97.08,49.94 95.86,51.16 81.08,51.16 80.16,52.07 80.16,53.59 80.47,53.9 85.04,53.9 87.63,56.49 D13.A
  Bottom 0.152: D13.A 87.63,58.32 86.72,59.23 v86.72,65.63 | v97.08,36.68 93.73,33.33 92.35,33.33 91.14,32.11 91.14,30.12 85.19,24.18 IC6.12
Q4  (via drill 0.35)
  Top 0.152: v65.08,16.87 67.21,14.73 R12.1 | v86.11,47.5 83.67,45.06 v83.67,33.17
  Bottom 0.152: IC2.16 85.19,67.92 86.11,67 86.11,59.39 85.19,58.47 85.19,56.64 D12.A 85.19,56.49 85.19,50.85 86.11,49.94 v86.11,47.5 | v65.08,16.87 65.08,30.73 64.16,31.65 IC5.5 | v83.67,33.17 83.67,29.82 78.49,24.64 78.49,19.46 73.3,14.28 73.3,14.12 72.85,13.67 68.28,13.67 67.36,14.58 R12.1
Q5
  Bottom 0.152: IC2.17 82.45,67.92 81.53,67 81.53,59.39 82.45,58.47 82.45,56.64 D11.A 82.6,56.49 82.6,52.98 84.12,51.46 84.12,47.8 85.8,46.13 87.94,46.13 88.85,45.21 88.85,40.49 91.14,38.2 91.14,35.76 90.53,35.15 89.92,35.15 88.85,36.22 88.85,39.57 88.54,39.88 73.15,39.88 69.34,36.07 69.34,31.8 IC5.3 69.19,31.65 65.38,27.84 65.38,22.81 65.68,22.5 65.68,16.56 64.77,15.65 R11.1
Q6  (via drill 0.35)
  Top 0.152: D10.A 80.01,56.64 80.62,56.64 82.14,58.17 86.87,58.17 87.48,58.78 88.09,58.78 88.54,59.23 88.54,61.37 87.33,62.59 85.95,62.59 80.62,67.92 80.01,67.92 IC2.18 | v70.87,36.68 70.87,45.36 73.3,47.8 v73.3,54.97 | v72.39,58.78 72.39,59.84 75.13,62.59 v76.35,62.59
  Bottom 0.152: 66.9,21.74 69.19,24.03 IC5.14 | 66.9,21.74 65.99,20.83 65.99,14.43 65.23,13.67 64.31,13.67 63.4,14.58 62.33,14.58 R10.1 | 66.9,21.74 65.68,22.96 65.68,26.16 70.87,31.34 v70.87,36.68 | v73.3,54.97 73.3,57.86 v72.39,58.78 | v76.35,62.59 78.49,62.59 79.1,61.98 79.1,57.56 80.01,56.64 D10.A
Q7
  Top 0.152: R9.1 59.74,14.73 59.74,19.76 64.01,24.03 IC5.12 64.16,24.03 64.77,24.03 66.29,22.5 77.88,22.5 79.1,23.72 79.1,33.48 81.23,35.61 81.23,41.25 78.64,43.84 78.64,52.38 77.57,53.44 77.57,56.49 D9.A 77.57,56.64 78.18,56.64 80.01,58.47 85.19,58.47 86.11,59.39 86.11,61.37 83.52,63.96 81.53,63.96 77.57,67.92 IC2.19
Q8  (via drill 0.35)
  Top 0.152: R8.1 52.12,14.73 52.12,15.95 54.56,18.39 JP6.8 54.71,18.54 54.71,23.11 55.32,23.72 55.32,35.61 55.63,35.92 55.63,45.52 v53.95,47.19 53.95,47.5 52.12,49.33 52.12,50.39 R24.2 52.12,50.55 53.34,51.77 53.34,65.18 54.56,66.4 54.56,67.92 IC1.12
  Bottom 0.152: v53.95,47.19 53.65,46.89 53.65,42.77 51.66,40.79 51.51,40.79 48.62,37.9 48.62,36.52 47.24,35.15 47.09,35.15 43.74,31.8 43.13,31.8 IC4.5 | D8.A 72.39,56.64 71.78,56.64 67.36,61.06 63.86,61.06 61.11,63.81 58.83,63.81 54.71,67.92 IC1.12
Q9  (via drill 0.35)
  Top 0.152: R25.2 49.53,50.39 50.44,49.48 50.44,43.38 48.62,41.55 48.62,36.07 48.31,35.76 48.31,31.8 IC4.3 48.16,31.65 v48.16,28.3 | v66.9,53.59 69.8,56.49 D7.A
  Bottom 0.152: D7.A 69.8,56.64 65.68,60.76 63.7,60.76 60.96,63.5 56.84,63.5 52.43,67.92 52.12,67.92 IC1.13 | R7.1 49.53,15.95 51.97,18.39 JP6.7 51.97,18.54 51.97,20.98 49.23,23.72 49.23,27.23 v48.16,28.3 | v66.9,53.59 64.77,53.59 63.7,52.53 51.51,52.53 49.53,50.55 R25.2
Q10
  Top 0.152: R6.1 47.09,14.58 48.16,14.58 49.07,13.67 52.43,13.67 55.63,16.87 55.63,33.33 58.67,36.37 58.67,40.79 66.29,48.41 66.29,55.58 67.21,56.49 D6.A
  Bottom 0.152: R6.1 47.09,14.73 47.09,15.95 49.53,18.39 JP6.6 49.53,18.54 48.31,19.76 48.31,24.03 IC4.14 | 47.09,53.75 47.09,56.95 48.62,58.47 48.62,67 49.53,67.92 IC1.14 | 47.09,53.75 47.09,50.55 R26.2 | 47.09,53.75 64.47,53.75 67.21,56.49 D6.A
Q11
  Top 0.152: R27.2 44.5,50.55 44.5,56.79 45.41,57.71 45.41,60.91 46.94,62.43 46.94,67.92 IC1.15
  Bottom 0.152: R5.1 44.5,14.73 44.5,15.95 46.94,18.39 JP6.5 46.94,18.54 43.13,22.35 IC4.12 43.13,24.64 36.73,31.04 36.73,35 34.44,37.29 34.44,41.4 34.75,41.71 51.66,41.71 53.03,43.08 53.03,45.52 49.38,49.17 45.72,49.17 44.5,50.39 R27.2 | D5.A 64.77,56.64 64.16,56.64 59.89,60.91 58.52,60.91 53.34,66.09 51.51,66.09 50.44,67.16 50.44,68.99 49.84,69.6 48.62,69.6 47.09,68.07 IC1.15
Q12  (via drill 0.35)
  Top 0.152: R28.2 41.91,56.79 43.13,58.01 43.13,66.7 44.35,67.92 IC1.16 | v62.18,53.14 62.18,56.49 D4.A | v49.53,51.77 50.75,50.55 50.75,33.78 49.53,32.56 49.53,23.42 44.5,18.39 JP6.4
  Bottom 0.152: v62.18,53.14 50.9,53.14 v49.53,51.77 47.24,49.48 46.63,49.48 45.41,50.7 45.41,55.88 43.43,57.86 43.43,67 44.35,67.92 IC1.16 | JP6.4 44.35,18.39 41.91,15.95 R4.1 41.91,14.58 41,13.67 36.42,13.67 35.81,14.28 35.81,14.43 34.75,15.49 32.31,15.49 26.06,21.74 26.06,24.64 21.95,28.75 IC3.5
Q13
  Top 0.152: IC1.17 41.91,67.92 41,67 41,58.01 39.47,56.49 39.47,50.55 R29.2 39.47,50.39 39.47,46.28 40.39,45.36 40.39,39.88 37.8,37.29 37.8,35.76 36.88,34.85 30.18,34.85 27.13,31.8 IC3.3 | D3.A 59.74,56.64 60.35,56.64 61.87,58.17 70.26,58.17 70.87,57.56 70.87,46.28 67.36,42.77 67.21,42.77 60.66,36.22 60.66,35.76 57.45,32.56 57.45,18.24 52.58,13.36 40.69,13.36 39.47,14.58 R3.1
  Bottom 0.152: R3.1 39.47,14.73 39.47,15.95 41.91,18.39 JP6.3 41.91,18.54 38.71,21.74 35.97,21.74 34.59,23.11 34.59,23.72 27.13,31.19 27.13,31.65 IC3.3
Q14  (via drill 0.35)
  Top 0.152: D2.A 57.15,52.53 v56.54,51.92 | v35.05,41.1 31.85,41.1 31.39,41.55 31.39,42.47 32.46,43.54 32.61,43.54 36.73,47.65 36.73,50.39 R30.2 | v41.6,33.93 41.6,30.73 37.03,26.16 37.03,23.27 35.97,22.2 28.96,22.2 27.13,24.03 IC3.14
  Bottom 0.152: 36.88,15.95 36.88,14.73 R2.1 | 36.88,15.95 39.32,18.39 JP6.2 | 36.88,15.95 32.31,15.95 27.13,21.13 27.13,24.03 IC3.14 | R30.2 36.73,50.55 36.73,56.95 35.81,57.86 35.81,64.41 39.32,67.92 IC1.18 | v56.54,51.92 55.63,51.92 53.34,49.63 53.34,42.93 51.51,41.1 41,41.1 | v35.05,41.1 41,41.1 | v41.6,33.93 41.6,35.15 41,35.76 41,41.1
Q15  (via drill 0.35)
  Top 0.152: v48.01,55.27 48.01,54.97 48.31,54.66 48.31,47.8 46.02,45.52 46.02,33.48 46.63,32.87 46.63,30.73 41.6,25.7 41.6,23.11 39.62,21.13 v38.41,21.13 | JP6.1 36.73,18.54 27.43,18.54 21.95,24.03 IC3.12
  Bottom 0.152: v48.01,55.27 49.23,56.49 54.56,56.49 D1.A | v38.41,21.13 38.41,20.07 36.88,18.54 JP6.1 | R31.2 34.29,56.79 35.51,58.01 35.51,63.2 | 35.51,63.2 35.51,66.7 36.73,67.92 IC1.19 | R1.1 34.29,14.73 31.85,14.73 22.55,24.03 21.95,24.03 IC3.12 21.95,24.18 21.03,25.09 21.03,32.11 14.94,38.2 14.94,53.75 15.54,54.36 16.92,54.36 18.14,55.58 18.14,55.73 19.2,56.79 20.73,56.79 27.13,63.2 35.51,63.2
RD  (via drill 0.35)
  Top 0.152: v57.76,13.06 37.03,13.06 35.2,14.88 35.2,15.34 v32.92,17.63
  Bottom 0.152: R20.1 29.57,60.6 29.57,50.39 28.96,49.78 24.23,49.78 23.32,50.7 20.42,50.7 IC9.11 20.27,50.7 18.75,49.17 18.75,42.77 22.86,38.66 22.86,31.34 28.04,26.16 28.04,23.72 30.18,21.59 30.18,20.37 v32.92,17.63 | v57.76,13.06 81.08,13.06 91.14,23.11 91.14,24.49 98.75,32.11 98.75,61.37 94.34,65.79 94.34,68.38 92.2,70.51 89.76,70.51 87.94,72.34 87.63,72.34 JP5.5
VCC  (via drill 0.35)
  Top 0.152: IC4.16 53.19,24.03 52.88,24.03 48.01,19.15 48.01,17.17 47.4,16.56 39.01,16.56 37.95,17.63 37.95,19.61 37.34,20.22 31.85,20.22 C1.1 | 15.54,46.74 12.04,43.23 8.99,43.23 IC10.14 | 15.54,46.74 17.53,46.74 18.75,45.52 18.75,44.76 IC9.14 | 14.94,56.79 14.94,47.35 15.54,46.74 | 14.94,56.79 14.94,58.78 15.54,59.39 18.75,59.39 21.34,61.98 21.34,64.57 27.58,70.81 28.35,70.81 31.09,68.07 34.29,68.07 IC1.20 | 14.94,56.79 21.34,56.79 21.95,56.19 21.95,52.22 26.82,47.35 28.35,47.35 31.09,44.6 32.31,44.6 C4.1 | IC6.16 C5.1 95.25,20.22 93.88,20.22 87.02,13.36 59.59,13.36 58.67,14.28 58.67,21.74 60.05,23.11 60.05,23.72 | C3.1 71.63,64.87 74.83,68.07 IC2.20 | 60.05,29.52 59.28,29.52 58.06,30.73 58.06,32.72 59.28,33.93 68.89,33.93 71.02,36.07 71.17,36.07 71.48,36.37 71.48,43.54 IC8.20 73.91,45.97 73.91,56.79 74.68,57.56 v75.59,57.56 | 60.05,29.52 68.43,29.52 73.76,24.18 74.22,24.18 IC5.16 | 60.05,29.52 60.05,23.72 | 60.05,23.72 v60.35,23.72
  Bottom 0.152: C1.1 31.85,20.37 31.85,23.88 32,24.03 IC3.16 32,24.18 32,24.79 25.45,31.34 25.45,38.05 IC9.14 | IC7.20 32.46,44.45 C4.1 | JP8.2 97.84,72.34 97.84,69.9 99.06,68.68 99.06,27.99 95.25,24.18 IC6.16 | IC8.20 67.67,44.45 C2.1 | v75.59,57.56 75.89,57.86 75.89,61.37 72.54,64.72 71.63,64.72 C3.1 | v60.35,23.72 60.35,23.42 59.44,22.5 56.08,22.5 54.56,24.03 53.34,24.03 IC4.16
WE  (via drill 0.35)
  Top 0.152: 79.86,52.22 79.86,53.75 81.08,54.97 85.5,54.97 86.72,56.19 86.72,57.56 87.63,58.47 88.24,58.47 89.15,59.39 89.15,71.42 90.07,72.34 JP5.6 | 79.86,52.22 79.86,51.92 80.92,50.85 95.71,50.85 96.47,50.09 96.47,20.22 88.7,12.45 26.52,12.45 15.85,23.11 15.85,32.26 14.94,33.17 14.94,43.54 16.46,45.06 16.46,45.67 IC10.2 | 79.86,52.22 v79.55,52.22
  Bottom 0.152: R19.1 68.58,63.5 73.91,58.17 73.91,55.12 76.5,52.53 79.25,52.53 v79.55,52.22
Z  (via drill 0.35)
  Top 0.152: v38.41,49.17 38.41,55.88 40.69,58.17 40.69,68.68 v41.91,69.9 | v63.7,70.05 v58.52,70.05 | v66.14,70.05 66.6,70.05 67.06,70.51 75.59,70.51 JP5.1
  Bottom 0.152: v38.41,49.17 35.05,45.82 28.04,45.82 IC9.2 | v41.91,69.9 58.37,69.9 v58.52,70.05 | v66.14,70.05 v63.7,70.05